# EAGLE design ledunit (EAGLE 6.6.0)
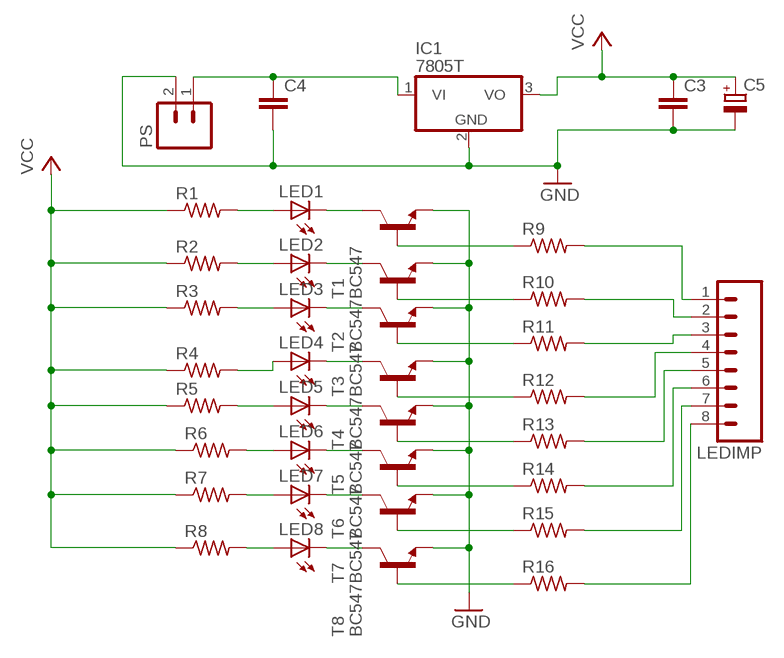
[diagram p0: schematic, sheet 1]

## Parts
C3  C-EU025-024X044  [C025-024X044]
C4  C-EU025-024X044  [C025-024X044]
C5  CPOL-EUE2,5-6E  [E2,5-6E]
IC1  7805T  [TO220H]
LED1  LED5MM  [LED5MM]
LED2  LED5MM  [LED5MM]
LED3  LED5MM  [LED5MM]
LED4  LED5MM  [LED5MM]
LED5  LED5MM  [LED5MM]
LED6  LED5MM  [LED5MM]
LED7  LED5MM  [LED5MM]
LED8  LED5MM  [LED5MM]
LEDIMP  M08  [08P]
PS  M02  [02P]
R1  R-US_0204/7  [0204/7]
R2  R-US_0204/7  [0204/7]
R3  R-US_0204/7  [0204/7]
R4  R-US_0204/7  [0204/7]
R5  R-US_0204/7  [0204/7]
R6  R-US_0204/7  [0204/7]
R7  R-US_0204/7  [0204/7]
R8  R-US_0204/7  [0204/7]
R9  R-US_0204/7  [0204/7]
R10  R-US_0204/7  [0204/7]
R11  R-US_0204/7  [0204/7]
R12  R-US_0204/7  [0204/7]
R13  R-US_0204/7  [0204/7]
R14  R-US_0204/7  [0204/7]
R15  R-US_0204/7  [0204/7]
R16  R-US_0204/7  [0204/7]
T1  BC547  [TO92]
T2  BC547  [TO92]
T3  BC547  [TO92]
T4  BC547  [TO92]
T5  BC547  [TO92]
T6  BC547  [TO92]
T7  BC547  [TO92]
T8  BC547  [TO92]

## Nets
GND: C3.2 C4.2 C5.- IC1.2(GND) PS.2 T1.1(E) T2.1(E) T3.1(E) T4.1(E) T5.1(E) T6.1(E) T7.1(E) T8.1(E)
N$1: LED8.A R8.2
N$2: LED7.A R7.2
N$3: LED6.A R6.2
N$4: LED5.A R5.2
N$5: LED4.A R4.2
N$6: LED3.A R3.2
N$7: LED2.A R2.2
N$8: LED1.A R1.2
N$9: LED1.K(C) T1.3(C)
N$10: LED2.K(C) T2.3(C)
N$11: LED3.K(C) T3.3(C)
N$12: LED4.K(C) T4.3(C)
N$13: LED5.K(C) T5.3(C)
N$14: LED6.K(C) T6.3(C)
N$15: LED7.K(C) T7.3(C)
N$16: LED8.K(C) T8.3(C)
N$17: R9.1 T1.2(B)
N$18: R10.1 T2.2(B)
N$19: R11.1 T3.2(B)
N$20: R12.1 T4.2(B)
N$21: R13.1 T5.2(B)
N$22: R14.1 T6.2(B)
N$23: R15.1 T7.2(B)
N$24: R16.1 T8.2(B)
N$25: LEDIMP.1 R9.2
N$26: LEDIMP.2 R10.2
N$27: LEDIMP.3 R11.2
N$28: LEDIMP.4 R12.2
N$29: LEDIMP.5 R13.2
N$30: LEDIMP.6 R14.2
N$31: LEDIMP.7 R15.2
N$32: LEDIMP.8 R16.2
N$33: C4.1 IC1.1(VI) PS.1
VCC: C3.1 C5.+ IC1.3(VO) R1.1 R2.1 R3.1 R4.1 R5.1 R6.1 R7.1 R8.1

## Library data of the parts
C3 C4 = rcl:C-EU: CAPACITOR, European symbol
C5 = rcl:CPOL-EU: POLARIZED CAPACITOR, European symbol
IC1 = linear:78*: Positive VOLTAGE REGULATOR Source: http://cache.national.com/ds/LM/LM78L05.pdf http://www.fairchildsemi.com/ds/LM/LM7805.pdf
LED1-LED8 = led:LED: LED OSRAM: - CHIPLED LG R971, LG N971, LY N971, LG Q971, LY Q971, LO R971, LY R971 LH N974, LH R974 LS Q976, LO Q976, LY Q976 LO Q996 - Hyper CHIPLED LW Q18S LB Q993, LB Q99A, LB R99A - SideLED LS A670, LO A670, LY A670, LG A670, LP A670 LB A673, LV A673, LT A673, LW A673 LH A674 LY A675 LS A676, LA A676, LO A676, LY A676, LW A676 LS A679, LY A679, LG A679 - Hyper Micro SIDELED® LS Y876, LA Y876, LO Y876, LY Y876 LT Y87S - SmartLED LW L88C, LW L88S LB L89C, LB L89S, LG L890 LS L89K, LO L89K, LY L89K LS L896, LA L896, LO L896, LY L896 - TOPLED LS T670, LO T670, LY T670, LG T670, LP T670 LSG T670, LSP T670, LSY T670, LOP T670, LYG T670 LG T671, LOG T671, LSG T671 LB T673, LV T673, LT T673, LW T673 LH T674 LS T676, LA T676, LO T676, LY T676, LB T676, LH T676, LSB T676, LW T676 LB T67C, LV T67C, LT T67C, LS T67K, LO T67K, LY T67K, LW E67C LS E67B, LA E67B, LO E67B, LY E67B, LB E67C, LV E67C, LT E67C LW T67C LS T679, LY T679, LG T679 LS T770, LO T770, LY T770, LG T770, LP T770 LB T773, LV T773, LT T773, LW T773 LH T774 LS E675, LA E675, LY E675, LS T675 LS T776, LA T776, LO T776, LY T776, LB T776 LHGB T686 LT T68C, LB T68C - Hyper Mini TOPLED® LB M676 - Mini TOPLED Santana® LG M470 LS M47K, LO M47K, LY M47K Source: http://www.osram.convergy.de LUXEON: - LUMILED® LXK2-PW12-R00, LXK2-PW12-S00, LXK2-PW14-U00, LXK2-PW14-V00 LXK2-PM12-R00, LXK2-PM12-S00, LXK2-PM14-U00 LXK2-PE12-Q00, LXK2-PE12-R00, LXK2-PE12-S00, LXK2-PE14-T00, LXK2-PE14-U00 LXK2-PB12-K00, LXK2-PB12-L00, LXK2-PB12-M00, LXK2-PB14-N00, LXK2-PB14-P00, LXK2-PB14-Q00 LXK2-PR12-L00, LXK2-PR12-M00, LXK2-PR14-Q00, LXK2-PR14-R00 LXK2-PD12-Q00, LXK2-PD12-R00, LXK2-PD12-S00 LXK2-PH12-R00, LXK2-PH12-S00 LXK2-PL12-P00, LXK2-PL12-Q00, LXK2-PL12-R00 Source: www.luxeon.com KINGBRIGHT: KA-3528ASYC Source: www.kingbright.com
LEDIMP = con-amp-quick:M08: AMP QUICK CONNECTOR; OC_FARNELL: unknown; OC_NEWARK: unknown
PS = CEDTv83:M02: AMP QUICK CONNECTOR
R1-R16 = rcl:R-US_: RESISTOR, American symbol
T1-T8 = transistor:BC547: NPN TRANSISTOR

## Net classes
0 default: width 0.406 mm, clearance 0.305 mm
1 VCC: width 0.61 mm, clearance 0.305 mm to class 0, clearance 0.305 mm
2 GND: width 0.61 mm, clearance 0.305 mm to class 0, clearance 0.305 mm to class 1, clearance 0.305 mm

## Board
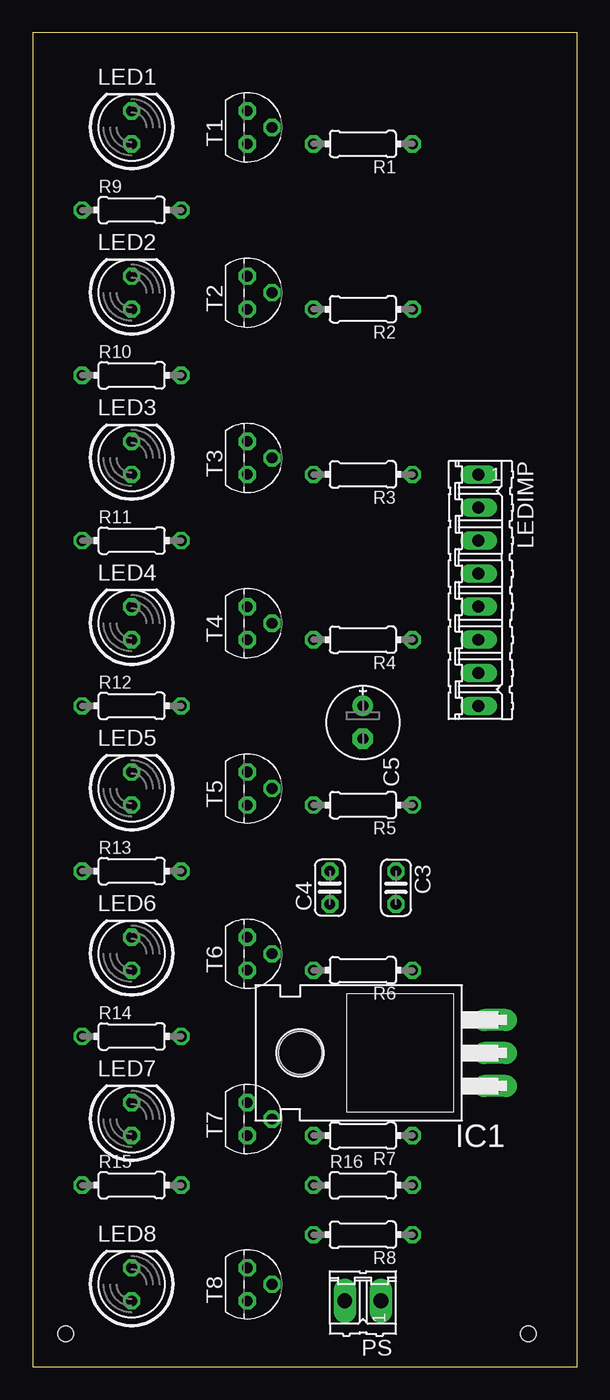
[diagram p1: board, top side]
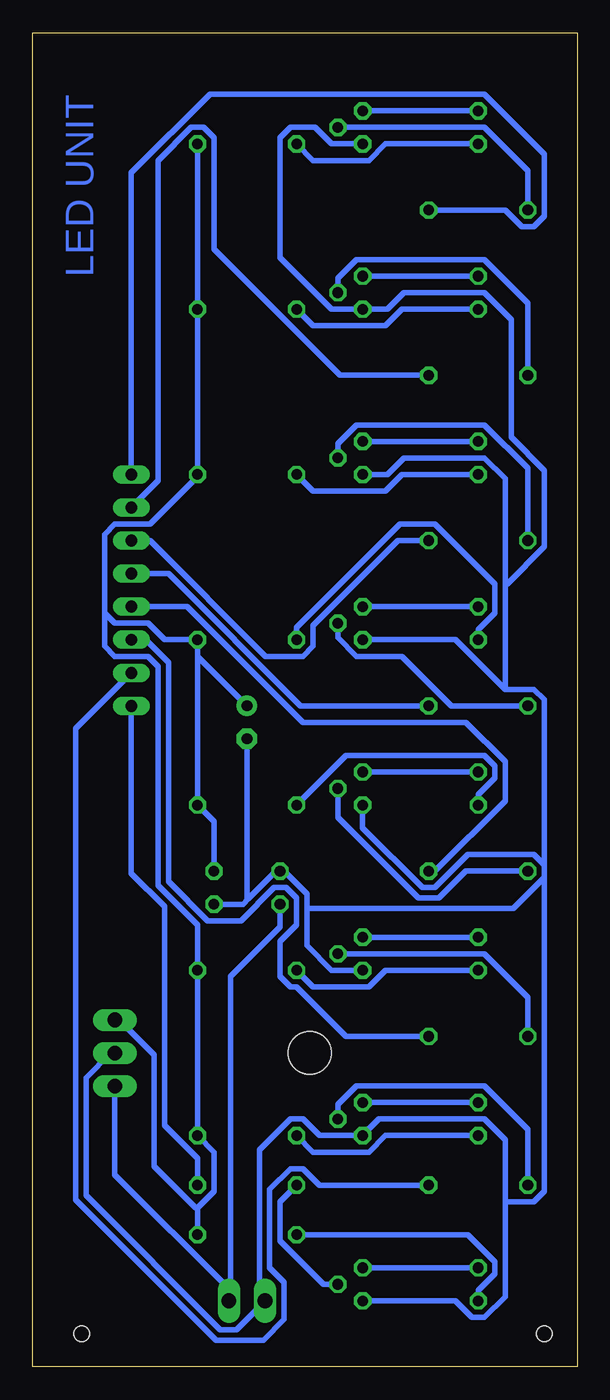
[diagram p2: board, bottom side, seen from below]

Size 41.89 x 102.54 mm. Coordinates in mm from the lower left corner, seen from the top.
Outline: 0,0 41.89,0 41.89,102.54 0,102.54 0,0
Copper layers (1*16): Top 0.035mm / dielectric 1.5mm / Bottom 0.035mm
Design rules "default": minimum track width 10mil, minimum drill 24mil, track to track 8mil, track to pad 8mil, pad to pad 8mil, via to via 8mil, smd to smd 8mil, copper to edge 40mil, drill to drill 8mil, minimum pad ring 10mil, minimum via ring 8mil, stop-mask expansion 4mil, vias tented up to drill 0mil, thermal gap 10mil
Holes 1.2 mm at 38.1,2.54 2.54,2.54

### Footprints (pad centres in the part's own frame; a part is rotated, then mirrored left to right if it is on the bottom)
C025-024X044 = drill 0.813 octagon: 1 -1.27,0; 2 1.27,0
E2,5-6E = drill 0.813 pad 1.575: + -1.27,0 | drill 0.813 pad 1.575 octagon: - 1.27,0
TO220H = drill 1.118 long: 1 -2.54,-10.16; 2 0,-10.16; 3 2.54,-10.16 | hole 3.302: 0,4.826
LED5MM = drill 0.813 octagon: A -1.27,0; K 1.27,0
08P = drill 0.914 long: 1 -8.89,0; 2 -6.35,0; 3 -3.81,0; 4 -1.27,0; 5 1.27,0; 6 3.81,0; 7 6.35,0; 8 8.89,0
02P = drill 1.143 long: 1 -1.397,0; 2 1.397,0
0204/7 = drill 0.813 octagon: 1 -3.81,0; 2 3.81,0
TO92 = drill 0.813 octagon: 1 1.27,0; 2 0,1.905; 3 -1.27,0

### Placement (x,y rotation side)
C3  27.94,36.83 270 top
C4  22.86,36.83 90 top
C5  25.4,49.53 270 top
IC1  25.4,24.13 90 top
LED1  7.62,95.25 90 top
LED2  7.62,82.55 90 top
LED3  7.62,69.85 90 top
LED4  7.62,57.15 90 top
LED5  7.62,44.45 90 top
LED6  7.62,31.75 90 top
LED7  7.62,19.05 90 top
LED8  7.62,6.35 90 top
LEDIMP  34.29,59.69 270 top
PS  25.4,5.08 180 top
R1  25.4,93.98 180 top
R2  25.4,81.28 180 top
R3  25.4,68.58 180 top
R4  25.4,55.88 180 top
R5  25.4,43.18 180 top
R6  25.4,30.48 180 top
R7  25.4,17.78 180 top
R8  25.4,10.16 180 top
R9  7.62,88.9 0 top
R10  7.62,76.2 0 top
R11  7.62,63.5 0 top
R12  7.62,50.8 0 top
R13  7.62,38.1 0 top
R14  7.62,25.4 0 top
R15  7.62,13.97 0 top
R16  25.4,13.97 0 top
T1  16.51,95.25 270 top
T2  16.51,82.55 270 top
T3  16.51,69.85 270 top
T4  16.51,57.15 270 top
T5  16.51,44.45 270 top
T6  16.51,31.75 270 top
T7  16.51,19.05 270 top
T8  16.51,6.35 270 top

### Tracks (layer width: path | path; a pad name or v marks a point on that pad's centre or on a via)
GND
  Bottom 0.406: T8.1 9.37,5.08 8.1,3.81 7.14,3.81 5.56,5.4 5.56,12.7 | 5.56,12.7 5.56,17.46 7.14,19.05 15.24,19.05 T7.1 19.84,17.78 21.11,19.05 22.07,19.05 24.45,16.67 24.45,4.76 PS.2 23.97,5.08 26.19,2.86 27.46,2.86 37.78,13.18 37.78,22.23 35.88,24.13 IC1.2 | T1.1 18.89,93.98 20.16,95.25 22.07,95.25 22.86,94.46 22.86,85.25 18.89,81.28 T2.1 14.61,81.28 13.33,82.55 7.14,82.55 5.08,80.49 5.08,71.44 2.54,68.9 2.54,63.02 5.4,60.17 5.56,60.17 | T6.1 18.89,30.48 20.8,32.38 20.8,35.24 | 20.8,35.24 20.8,36.35 22.54,38.1 C4.2 23.18,38.1 25.32,35.96 | C3.2 25.72,35.56 25.32,35.96 | T5.1 16.51,41.43 11.91,36.83 10.95,36.83 8.41,39.37 3.33,39.37 2.62,38.66 | 2.62,38.66 2.54,38.58 2.54,37.62 | 2.54,37.62 4.92,35.24 20.8,35.24 | T4.1 9.37,55.88 5.64,52.15 | 5.64,52.15 5.56,52.07 3.33,52.07 2.54,51.28 2.54,38.73 2.62,38.66 | T3.1 14.61,68.58 13.33,69.85 7.14,69.85 5.56,68.26 5.56,60.17 | 5.56,60.17 5.56,52.23 5.64,52.15 | C5.- 25.4,36.04 25.32,35.96 | 5.56,12.7 3.33,12.7 2.54,13.49 2.54,37.62
N$1
  Bottom 0.406: LED8.A 7.62,5.87 6.35,7.14 6.35,8.1 8.41,10.16 R8.2
N$2
  Bottom 0.406: LED7.A 14.76,17.78 16.03,16.51 20.32,16.51 R7.2
N$3
  Bottom 0.406: LED6.A 14.76,30.48 16.03,29.21 20.32,29.21 R6.2
N$4
  Bottom 0.406: LED5.A 7.62,43.97 6.35,45.24 6.35,46.2 7.14,46.99 17.78,46.99 R5.2
N$5
  Bottom 0.406: LED4.A 7.62,56.67 6.35,57.94 6.35,60.17 10.95,64.77 13.65,64.77 21.59,56.83 R4.2
N$6
  Bottom 0.406: LED3.A 13.49,68.58 14.76,67.31 20.32,67.31 R3.2
N$7
  Bottom 0.406: LED2.A 13.49,81.28 14.76,80.01 20.32,80.01 R2.2
N$8
  Bottom 0.406: LED1.A 14.76,93.98 16.03,92.71 20.32,92.71 R1.2
N$9
  Bottom 0.406: T1.3 LED1.K
N$10
  Bottom 0.406: T2.3 LED2.K
N$11
  Bottom 0.406: T3.3 LED3.K
N$12
  Bottom 0.406: T4.3 LED4.K
N$13
  Bottom 0.406: T5.3 LED5.K
N$14
  Bottom 0.406: T6.3 LED6.K
N$15
  Bottom 0.406: T7.3 LED7.K
N$16
  Bottom 0.406: T8.3 LED8.K
N$17
  Bottom 0.406: R9.1 3.81,91.92 7.14,95.25 T1.2
N$18
  Bottom 0.406: R10.1 3.81,81.76 7.14,85.09 16.99,85.09 18.41,83.66 T2.2
N$19
  Bottom 0.406: R11.1 3.81,69.06 7.14,72.39 16.99,72.39 18.41,70.96 T3.2
N$20
  Bottom 0.406: R12.1 9.68,50.8 13.49,54.61 16.99,54.61 18.41,56.04 T4.2
N$21
  Bottom 0.406: R13.1 8.57,38.1 10.64,36.04 12.22,36.04 18.41,42.23 T5.2
N$22
  Bottom 0.406: R14.1 3.81,28.42 7.14,31.75 T6.2
N$23
  Bottom 0.406: R15.1 3.81,18.26 7.14,21.59 16.99,21.59 18.41,20.16 T7.2
N$24
  Bottom 0.406: T8.2 19.53,6.35 22.86,9.68 22.86,12.7 R16.1
N$25
  Bottom 0.406: R9.2 5.56,88.9 4.29,87.63 3.33,87.63 2.54,88.42 2.54,93.19 7.14,97.79 28.26,97.79 34.29,91.76 LEDIMP.1
N$26
  Bottom 0.406: R10.2 18.26,76.2 27.94,85.88 27.94,94.46 28.73,95.25 29.69,95.25 32.23,92.71 32.23,68.1 LEDIMP.2
N$27
  Bottom 0.406: R11.2 13.81,63.5 20.32,56.99 20.32,55.4 21.11,54.61 23.97,54.61 32.86,63.5 LEDIMP.3
N$28
  Bottom 0.406: R12.2 21.27,50.8 31.43,60.96 LEDIMP.4
N$29
  Bottom 0.406: R13.2 10.95,38.1 5.56,43.5 5.56,46.51 8.57,49.53 21.11,49.53 30,58.42 LEDIMP.5
N$30
  Bottom 0.406: R14.2 17.78,25.4 21.59,29.21 22.07,29.21 22.86,30 22.86,32.7 21.59,33.97 21.59,36.04 22.38,36.83 23.34,36.83 25.88,34.29 28.42,34.29 31.43,37.31 31.43,54.13 33.18,55.88 LEDIMP.6
N$31
  Bottom 0.406: R15.2 19.84,13.97 21.11,15.24 22.07,15.24 23.65,13.65 23.65,7.62 22.54,6.51 22.54,3.65 24.13,2.06 27.78,2.06 38.58,12.86 38.58,49.05 LEDIMP.7
N$32
  Bottom 0.406: R16.2 29.21,16.03 31.75,18.57 31.75,35.4 34.29,37.94 LEDIMP.8
N$33
  Bottom 0.406: C4.1 22.86,33.81 26.67,30 26.67,5.08 PS.1 26.83,6.03 35.56,14.76 IC1.1
VCC
  Bottom 0.406: 29.21,12.22 R8.1 | 29.21,12.22 27.94,13.49 27.94,16.51 R7.1 R6.1 29.21,33.97 32.23,36.99 32.23,53.82 33.02,54.61 35.56,54.61 36.35,55.4 36.35,57.78 36.27,57.86 | IC1.3 35.24,26.67 32.54,23.97 32.54,15.4 29.37,12.22 29.21,12.22 | C3.1 27.94,41.91 R5.1 29.21,54.61 | 29.21,54.61 R4.1 31.75,55.88 33.02,57.15 35.56,57.15 36.27,57.86 | C5.+ 29.21,54.61 | R1.1 R2.1 R3.1 29.21,68.42 32.86,64.77 35.56,64.77 36.35,63.98 36.35,57.94 36.27,57.86

### Text on the board
Bottom: LED UNIT